# Altium schematic sheet [08]-PumpDriverUnit.SchDoc: RS232 and RS422/RS485 (part 2 of 3)
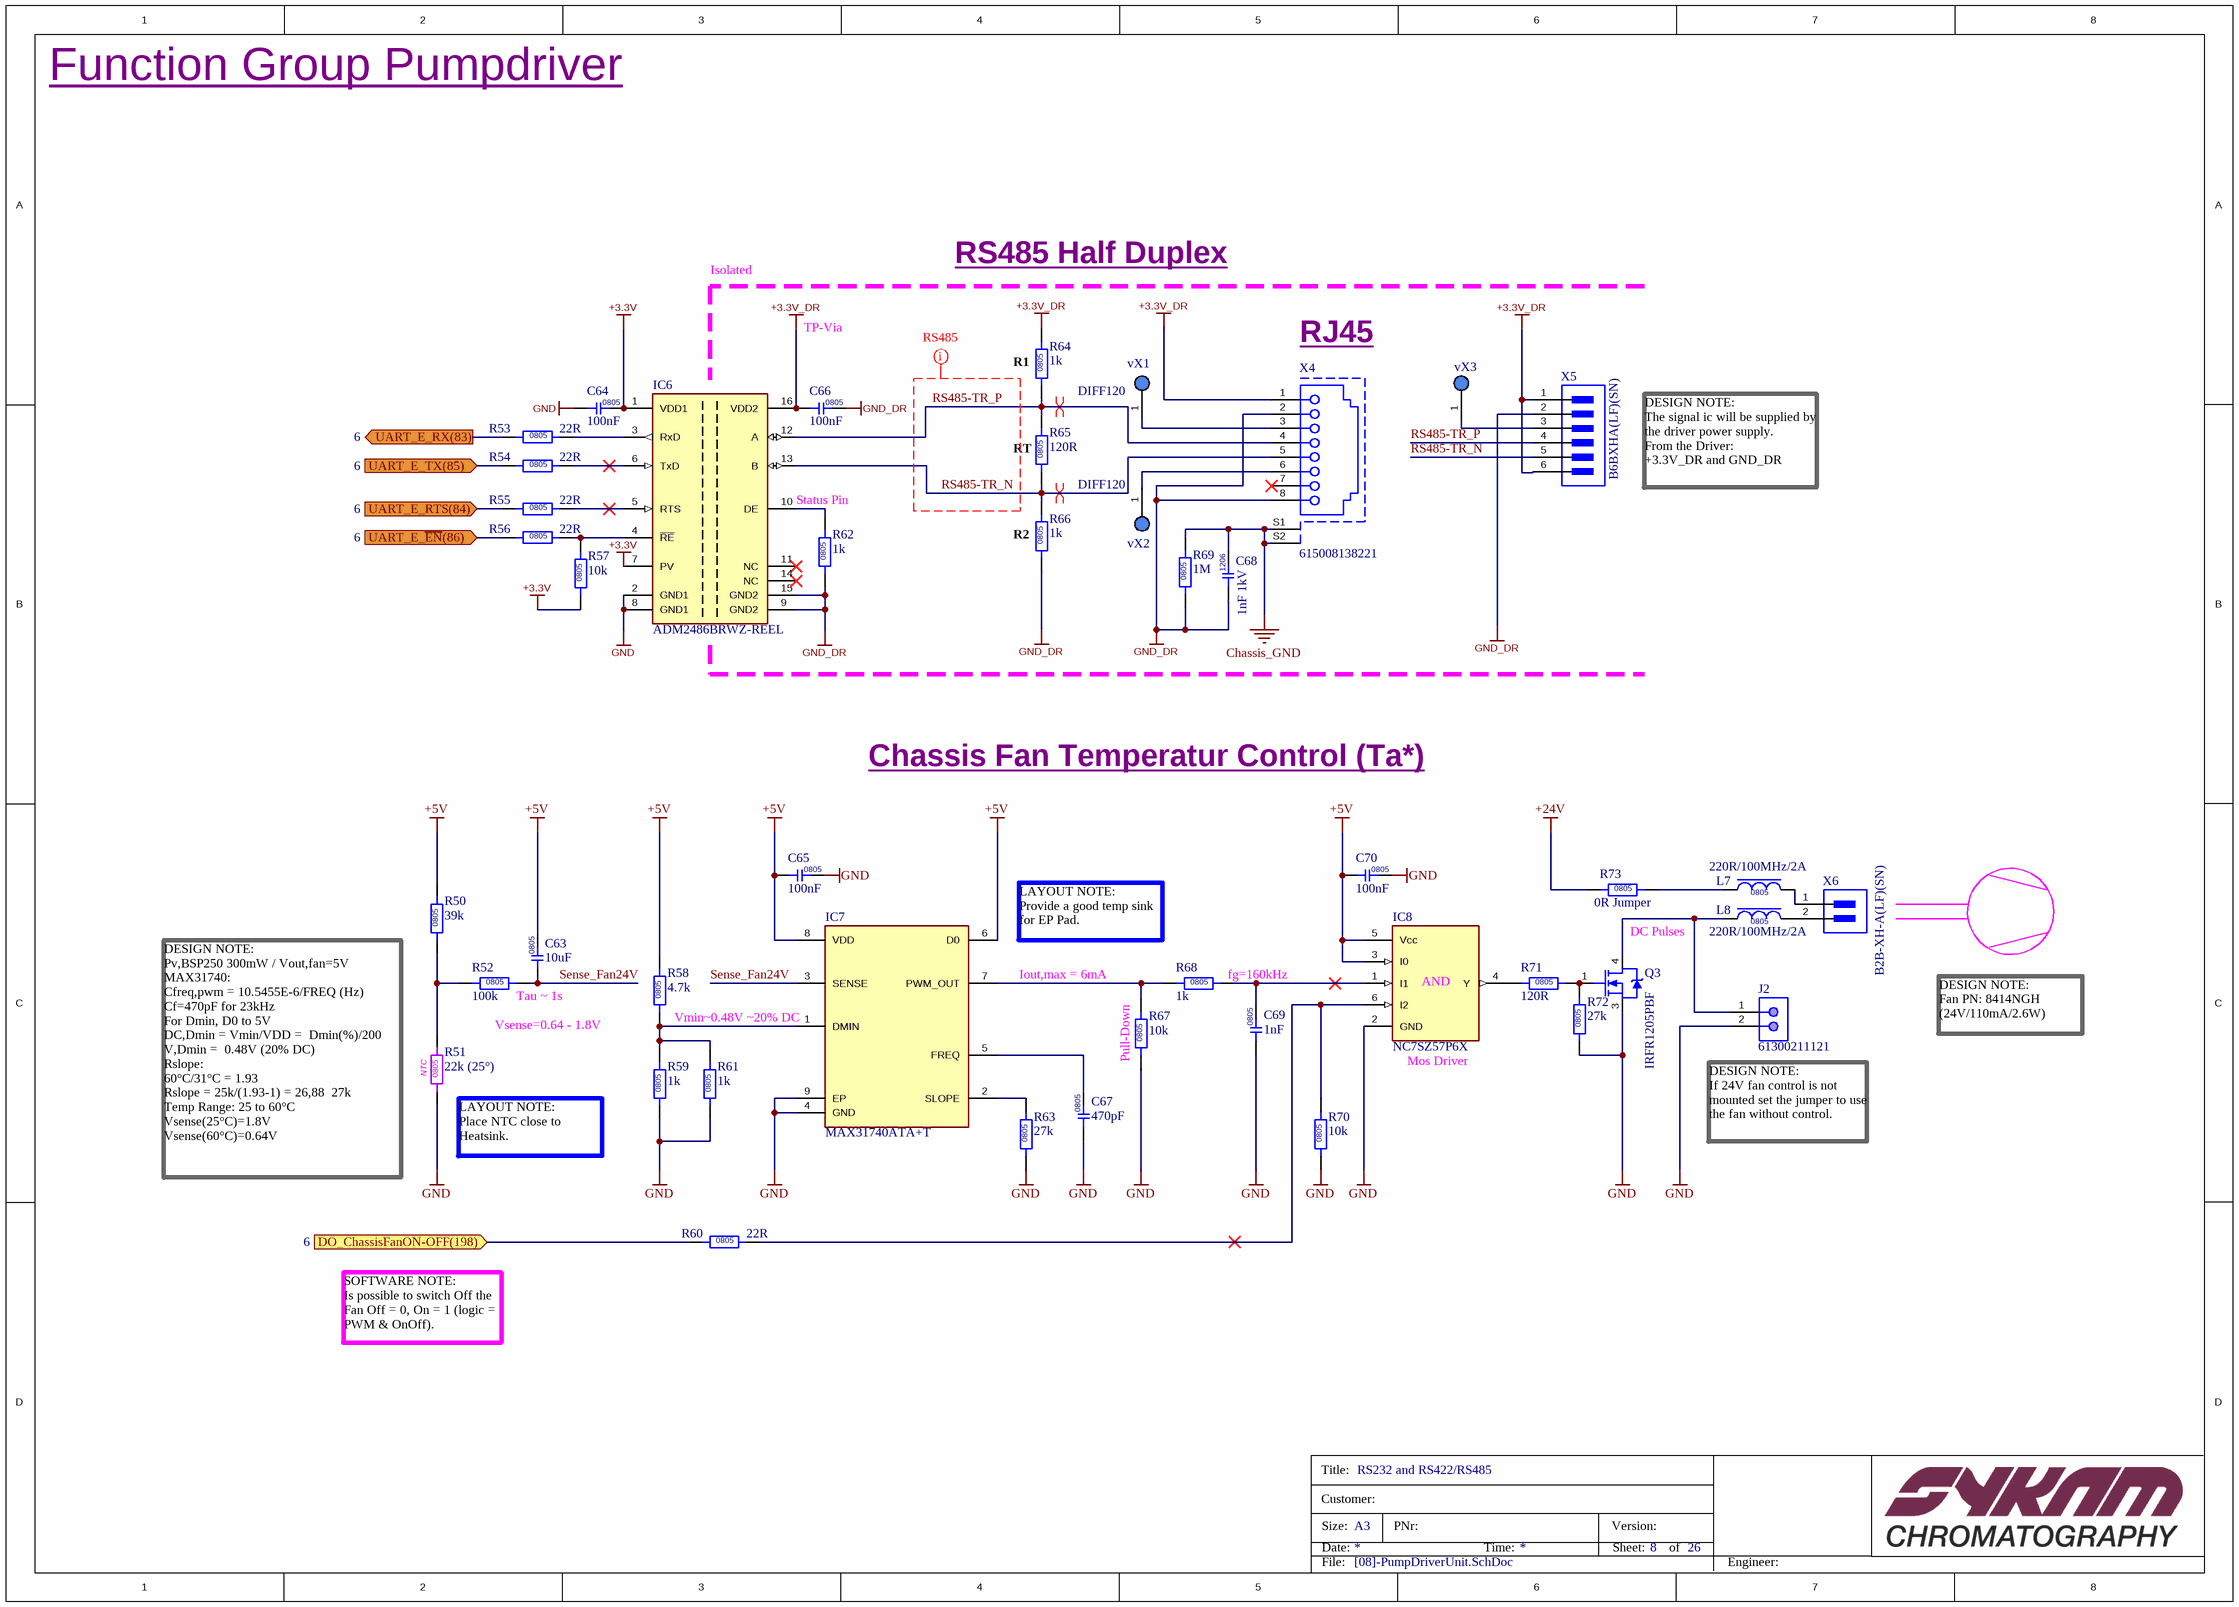
[diagram p1: [08]-PumpDriverUnit.SchDoc]
## Library data of the parts
C63 = C_10uF_GRM21BR6YA106ME43L: 0805 10 uF 50 V ±20% Tolerance X5R Multilayer Ceramic Capacitor; Manufacturer: Murata; Voltage Rating: 35V; Supplier 1: Digi-Key; Manufacturer Part Number: GRM21BR6YA106ME43L; RoHS: Yes; Category: Ceramic Capacitors; Stock 1: 143980; Pricing 1: 1=0,48000, 10=0,33200, 100=0,19920, 500=0,14942, 1000=0,12617 (USD); Mount: Surface Mount; Case/Package: 0805; Weight: 0.000335oz; Case Code (Imperial): 0805; Case Code (Metric): 2012; Min Operating Temperature: -55°C; Max Operating Temperature: 85°C; Tolerance: 20%; Capacitance: 10uF; Packaging: Tape and Reel; Dielectric: X5R; Termination: SMD/SMT; Voltage Rating (DC): 35V; Package Quantity: 3000; Length: 0.079inch; Height: 1.25mm; Width: 0.049inch; Thickness: 0.057inch; ComponentLink1URL: http://www.mouser.com/ds/2/281/c02e-2905.pdf?src-supplier=Mouser; ComponentLink1Description: http://www.mouser.com/ds/2/281/c02e-2905.pdf?src-supplier=Mouser; ComponentLink2URL: http://search.murata.co.jp/Ceramy/image/img/A01X/G101/ENG/GRM21BR6YA106ME43-01.pdf?src-supplier=Digi-Key; ComponentLink2Description: http://search.murata.co.jp/Ceramy/image/img/A01X/G101/ENG/GRM21BR6YA106ME43-01.pdf?src-supplier=Digi-Key; Supplier Part Number 1: 490-10515-6-ND
C64 C66 = C_100nF_CC0805KRX7R9BB104: CAP CER 0.1UF 50V X7R 0805; Manufacturer: Yageo; Material: Ceramic; Tolerance: 10%; Insulation Resistance: 100GR; Supplier 1: Digi-Key; Manufacturer Part Number: CC0805KRX7R9BB104; RoHS: Yes; Category: Ceramic Capacitors; Mount: Surface Mount; Case/Package: 0805; Number of Pins: 2; Case Code (Metric): 2012; Case Code (Imperial): 0805; Min Operating Temperature: -55°C; Max Operating Temperature: 125°C; Packaging: Tape and Reel; Capacitance: 100nF; Voltage Rating: 50V; Package Quantity: 1; Dielectric: X7R; Termination: SMD/SMT; Voltage: 50V; Length: 2mm; Height: 0.85mm; Width: 0.049inch; Thickness: 0.033inch; Depth: 1.25mm; Radiation Hardening: No; REACH SVHC: No SVHC; Lead Free: Lead Free; Halogen Free: Halogen Free; ComponentLink1URL: https://datasheet.ciiva.com/11786/0900766b80d84f1d-11786009.pdf?src-supplier=RSComponents; ComponentLink1Description: https://datasheet.ciiva.com/11786/0900766b80d84f1d-11786009.pdf?src-supplier=RSComponents; ComponentLink2URL: https://datasheet.ciiva.com/11464/upy-gphc-x7r-6-3v-to-50v-8-11464757.pdf?src-supplier=Avnet; ComponentLink2Description: https://datasheet.ciiva.com/11464/upy-gphc-x7r-6-3v-to-50v-8-11464757.pdf?src-supplier=Avnet; ComponentLink3URL: https://datasheet.ciiva.com/28450/1489800-28450805.pdf?src-supplier=Element14; ComponentLink3Description: https://datasheet.ciiva.com/28450/1489800-28450805.pdf?src-supplier=Element14; ComponentLink4URL: https://datasheet.ciiva.com/155/mlccorderingcode-155929.pdf?src-supplier=Digi-Key; ComponentLink4Description: https://datasheet.ciiva.com/155/mlccorderingcode-155929.pdf?src-supplier=Digi-Key; ComponentLink5URL: https://datasheet.ciiva.com/155/mlccorderingcode-155930.pdf?src-supplier=Digi-Key; ComponentLink5Description: https://datasheet.ciiva.com/155/mlccorderingcode-155930.pdf?src-supplier=Digi-Key; ComponentLink6URL: https://datasheet.ciiva.com/155/mlccorderingcode-155931.pdf?src-supplier=Digi-Key; ComponentLink6Description: https://datasheet.ciiva.com/155/mlccorderingcode-155931.pdf?src-supplier=Digi-Key; ComponentLink7URL: https://datasheet.ciiva.com/46393/1734573-46393307.pdf?src-supplier=Element14; ComponentLink7Description: https://datasheet.ciiva.com/46393/1734573-46393307.pdf?src-supplier=Element14; ComponentLink8URL: https://datasheet.ciiva.com/16625/upy-gphc-x7r-6-3v-to-50v-8-16625549.pdf?src-supplier=Avnet+Europe; ComponentLink8Description: https://datasheet.ciiva.com/16625/upy-gphc-x7r-6-3v-to-50v-8-16625549.pdf?src-supplier=Avnet+Europe; ComponentLink9URL: https://datasheet.ciiva.com/29242/445210-da-01-en-kerko-chip-0805-x7r-0-1uf-10proz-50vg-29242074.pdf?src-supplier=Conrad; ComponentLink9Description: https://datasheet.ciiva.com/29242/445210-da-01-en-kerko-chip-0805-x7r-0-1uf-10proz-50vg-29242074.pdf?src-supplier=Conrad; Supplier Part Number 1: 311-1140-6-ND; Stock 1: 7118979
C65 C70 = C_100nF_CC0805KRX7R9BB104: CAP CER 0.1UF 50V X7R 0805; Manufacturer: Yageo; Material: Ceramic; Tolerance: 10%; Insulation Resistance: 100GR; PCBChecked: initials after Checked; Supplier 1: Digi-Key; Manufacturer Part Number: CC0805KRX7R9BB104; RoHS: Yes; Category: Ceramic Capacitors; Mount: Surface Mount; Case/Package: 0805; Number of Pins: 2; Case Code (Metric): 2012; Case Code (Imperial): 0805; Min Operating Temperature: -55°C; Max Operating Temperature: 125°C; Packaging: Tape and Reel; Capacitance: 100nF; Voltage Rating: 50V; Package Quantity: 1; Dielectric: X7R; Termination: SMD/SMT; Voltage: 50V; Length: 2mm; Height: 0.85mm; Width: 0.049inch; Thickness: 0.033inch; Depth: 1.25mm; Radiation Hardening: No; REACH SVHC: No SVHC; Lead Free: Lead Free; Halogen Free: Halogen Free; ComponentLink1URL: https://datasheet.ciiva.com/11786/0900766b80d84f1d-11786009.pdf?src-supplier=RSComponents; ComponentLink1Description: https://datasheet.ciiva.com/11786/0900766b80d84f1d-11786009.pdf?src-supplier=RSComponents; ComponentLink2URL: https://datasheet.ciiva.com/11464/upy-gphc-x7r-6-3v-to-50v-8-11464757.pdf?src-supplier=Avnet; ComponentLink2Description: https://datasheet.ciiva.com/11464/upy-gphc-x7r-6-3v-to-50v-8-11464757.pdf?src-supplier=Avnet; ComponentLink3URL: https://datasheet.ciiva.com/28450/1489800-28450805.pdf?src-supplier=Element14; ComponentLink3Description: https://datasheet.ciiva.com/28450/1489800-28450805.pdf?src-supplier=Element14; ComponentLink4URL: https://datasheet.ciiva.com/155/mlccorderingcode-155929.pdf?src-supplier=Digi-Key; ComponentLink4Description: https://datasheet.ciiva.com/155/mlccorderingcode-155929.pdf?src-supplier=Digi-Key; ComponentLink5URL: https://datasheet.ciiva.com/155/mlccorderingcode-155930.pdf?src-supplier=Digi-Key; ComponentLink5Description: https://datasheet.ciiva.com/155/mlccorderingcode-155930.pdf?src-supplier=Digi-Key; ComponentLink6URL: https://datasheet.ciiva.com/155/mlccorderingcode-155931.pdf?src-supplier=Digi-Key; ComponentLink6Description: https://datasheet.ciiva.com/155/mlccorderingcode-155931.pdf?src-supplier=Digi-Key; ComponentLink7URL: https://datasheet.ciiva.com/46393/1734573-46393307.pdf?src-supplier=Element14; ComponentLink7Description: https://datasheet.ciiva.com/46393/1734573-46393307.pdf?src-supplier=Element14; ComponentLink8URL: https://datasheet.ciiva.com/16625/upy-gphc-x7r-6-3v-to-50v-8-16625549.pdf?src-supplier=Avnet+Europe; ComponentLink8Description: https://datasheet.ciiva.com/16625/upy-gphc-x7r-6-3v-to-50v-8-16625549.pdf?src-supplier=Avnet+Europe; ComponentLink9URL: https://datasheet.ciiva.com/29242/445210-da-01-en-kerko-chip-0805-x7r-0-1uf-10proz-50vg-29242074.pdf?src-supplier=Conrad; ComponentLink9Description: https://datasheet.ciiva.com/29242/445210-da-01-en-kerko-chip-0805-x7r-0-1uf-10proz-50vg-29242074.pdf?src-supplier=Conrad; Supplier Part Number 1: 311-1140-6-ND; Stock 1: 7118979; IPC7352C: done; SCHChecked: Initials after checked
C67 = C_470pF_08051A471JAT2A: AVX - 08051A471JAT2A - SMD Multilayer Ceramic Capacitor, 470 pF, 100 V, 0805 [2012 Metric], ± 5%, C0G / NP0, AVX 0805 MLCC; Manufacturer: Kyocera AVX; Voltage Rating: 100V; Dissipation Factor: 2.5%; Temperature Coefficient: 30ppm/°C; Insulation Resistance: 100GR; Supplier 1: Farnell; Manufacturer Part Number: 08051A471JAT2A; RoHS: Yes; Category: Ceramic Capacitors; Stock 1: 24000; Pricing 1: 4000=0,03540, 20000=0,02240 (EUR); Mount: Surface Mount,PCB; Case/Package: 0805; Number of Pins: 2; Case Code (Imperial): 0805; Case Code (Metric): 2012; Contact Plating: Tin,Matte; Min Operating Temperature: -55°C; Max Operating Temperature: 125°C; Capacitance: 470pF; Tolerance: 5%; Voltage Rating (DC): 100V; Packaging: Tape and Reel; Dielectric: C0G; Package Quantity: 1; Termination: SMD/SMT; Voltage: 100V; Length: 2.01mm; Width: 1.25mm; Height: 0.94mm; Thickness: 0.037inch; Depth: 1.25mm; Radiation Hardening: No; REACH SVHC: No SVHC; Lead Free: Lead Free; ComponentLink1URL: https://datasheet.ciiva.com/11787/0900766b802d4697-11787179.pdf?src-supplier=RSComponents; ComponentLink1Description: https://datasheet.ciiva.com/11787/0900766b802d4697-11787179.pdf?src-supplier=RSComponents; ComponentLink2URL: https://datasheet.ciiva.com/19476/2010384-19476174.pdf?src-supplier=Jameco; ComponentLink2Description: https://datasheet.ciiva.com/19476/2010384-19476174.pdf?src-supplier=Jameco; ComponentLink3URL: https://datasheet.ciiva.com/11536/ccog-11536997.pdf?src-supplier=Avnet; ComponentLink3Description: https://datasheet.ciiva.com/11536/ccog-11536997.pdf?src-supplier=Avnet; ComponentLink4URL: https://datasheet.ciiva.com/14590/70001042-14590309.pdf?src-supplier=Allied+Electronics; ComponentLink4Description: https://datasheet.ciiva.com/14590/70001042-14590309.pdf?src-supplier=Allied+Electronics; ComponentLink5URL: https://datasheet.ciiva.com/14594/70001042-14594869.pdf?src-supplier=Allied+Electronics; ComponentLink5Description: https://datasheet.ciiva.com/14594/70001042-14594869.pdf?src-supplier=Allied+Electronics; ComponentLink6URL: https://datasheet.ciiva.com/2987/ccog-2987926.pdf?src-supplier=Avnet; ComponentLink6Description: https://datasheet.ciiva.com/2987/ccog-2987926.pdf?src-supplier=Avnet; ComponentLink7URL: https://datasheet.ciiva.com/5424/ccog-243403-5424886.pdf?src-supplier=Mouser; ComponentLink7Description: https://datasheet.ciiva.com/5424/ccog-243403-5424886.pdf?src-supplier=Mouser; ComponentLink8URL: https://datasheet.ciiva.com/28546/759117-28546679.pdf?src-supplier=Element14; ComponentLink8Description: https://datasheet.ciiva.com/28546/759117-28546679.pdf?src-supplier=Element14; ComponentLink9URL: https://datasheet.ciiva.com/151/ccog-151179.pdf?src-supplier=Digi-Key; ComponentLink9Description: https://datasheet.ciiva.com/151/ccog-151179.pdf?src-supplier=Digi-Key; ComponentLink10URL: https://datasheet.ciiva.com/151/ccog-151180.pdf?src-supplier=Digi-Key; ComponentLink10Description: https://datasheet.ciiva.com/151/ccog-151180.pdf?src-supplier=Digi-Key; ComponentLink11URL: https://datasheet.ciiva.com/6150/26712-6150332.pdf?src-supplier=Farnell; ComponentLink11Description: https://datasheet.ciiva.com/6150/26712-6150332.pdf?src-supplier=Farnell; ComponentLink12URL: https://datasheet.ciiva.com/151/ccog-151181.pdf?src-supplier=Digi-Key; ComponentLink12Description: https://datasheet.ciiva.com/151/ccog-151181.pdf?src-supplier=Digi-Key; ComponentLink13URL: https://datasheet.ciiva.com/7811/759117-7811903.pdf?src-supplier=Element14; ComponentLink13Description: https://datasheet.ciiva.com/7811/759117-7811903.pdf?src-supplier=Element14; Supplier Part Number 1: 2280932
C68 = C_1nF-1kV-CGA5F1X7S3A102M085AE: CAP CER 1000PF 1KV X7S 1206; Manufacturer: TDK; Tolerance: 20%; Supplier 1: Mouser; Manufacturer Part Number: CGA5F1X7S3A102M085AE; RoHS: Yes; Category: Ceramic Capacitors; Stock 1: 11858; Pricing 1: 1=0,94000, 10=0,71800, 100=0,51400, 500=0,39800, 1000=0,34300, 4000=0,25700 (USD); Mount: Surface Mount; Case/Package: 1206; Weight: 0.000571oz; Case Code (Imperial): 1206; Case Code (Metric): 3216; Min Operating Temperature: -55°C; Max Operating Temperature: 125°C; Features: Soft Termination; Dielectric: X7S; Package Quantity: 4000; Packaging: Tape and Reel; Capacitance: 1nF; Voltage Rating: 1kV; Termination: SMD/SMT; Voltage Rating (DC): 1kV; Length: 0.126inch; Height: 0.85mm; Width: 0.063inch; Thickness: 0.039inch; Ratings: AEC-Q200; ComponentLink1URL: http://www.mouser.com/ds/2/400/lcc_commercial_soft_en-775842.pdf?src-supplier=Mouser; ComponentLink1Description: http://www.mouser.com/ds/2/400/lcc_commercial_soft_en-775842.pdf?src-supplier=Mouser; ComponentLink2URL: https://product.tdk.com/info/en/catalog/spec/mlccspec_automotive_highvoltage_en.pdf?src-supplier=Digi-Key; ComponentLink2Description: https://product.tdk.com/info/en/catalog/spec/mlccspec_automotive_highvoltage_en.pdf?src-supplier=Digi-Key; ComponentLink3URL: https://product.tdk.com/info/en/catalog/datasheets/mlcc_automotive_highvoltage_en.pdf?src-supplier=Digi-Key; ComponentLink3Description: https://product.tdk.com/info/en/catalog/datasheets/mlcc_automotive_highvoltage_en.pdf?src-supplier=Digi-Key; ComponentLink4URL: http://product.tdk.com/capacitor/mlcc/en/documents/mlcc_automotive_soft_en.pdf?src-supplier=Avnet; ComponentLink4Description: http://product.tdk.com/capacitor/mlcc/en/documents/mlcc_automotive_soft_en.pdf?src-supplier=Avnet; Supplier Part Number 1: 810-CGA5F1X7S3A102ME
C69 = C_1nF_C0805C102K5RAC7411: Multilayer Ceramic Capacitors MLCC - SMD/SMT 50volts 1000pF X7R 10%; Manufacturer: KEMET; Voltage Rating: 50V; Manufacturer Part Number: C0805C102K5RAC7411; RoHS: Yes; Category: Ceramic Capacitors; Stock 1: 30000; Pricing 1: 15000=0,01862, 30000=0,01764 (USD); Mount: Surface Mount; Case/Package: 0805; Case Code (Metric): 2012; Case Code (Imperial): 0805; Dielectric Material: Ceramic; Min Operating Temperature: -55°C; Max Operating Temperature: 125°C; Termination: SMD/SMT; Capacitance: 1nF; Package Quantity: 15000; Voltage Rating (DC): 50V; Tolerance: 10%; Packaging: Tape and Reel; Dielectric: X7R; Length: 0.079inch; Height: 0.78mm; Thickness: 0.035inch; Width: 0.049inch; ComponentLink1URL: http://components.arrow.com/part/dataview/0323_00324664?src-supplier=Arrow+Europe; ComponentLink1Description: http://components.arrow.com/part/dataview/0323_00324664?src-supplier=Arrow+Europe; ComponentLink2URL: http://www.mouser.com/ds/2/212/KEM_C1002_X7R_SMD-1102033.pdf?src-supplier=Mouser; ComponentLink2Description: http://www.mouser.com/ds/2/212/KEM_C1002_X7R_SMD-1102033.pdf?src-supplier=Mouser; ComponentLink3URL: https://api.kemet.com/component-edge/download/datasheet/C0805C102K5RAC7411.pdf?src-supplier=Digi-Key; ComponentLink3Description: https://api.kemet.com/component-edge/download/datasheet/C0805C102K5RAC7411.pdf?src-supplier=Digi-Key; Supplier 1: Digi-Key; Supplier Part Number 1: 311-1127-1-ND
IC6 = IC_ADM2486BRWZ-REEL: Single Transmitter/Receiver RS-485 16-Pin SOIC W T/R; Manufacturer: Analog Devices; Number of Transmitters: 1; Logic Function: Transceiver; Number of Channels: 3; Data Rate: 20Mbps; Propagation Delay: 55ns; Max Supply Voltage: 5.5V; Min Supply Voltage: 2.7V; Nominal Supply Current: 3mA; Channel Type: Bidirectional; Isolated Power: No; Pulse Width Distortion (PWD): 5ns; Isolation Voltage: 2.5kV; Operating Supply Voltage: 5V; Simplex/Duplex: Half Duplex; Supplier 1: Mouser; Manufacturer Part Number: ADM2486BRWZ-REEL; RoHS: Yes; Category: Interface ICs; Mount: Surface Mount; Case/Package: SOIC; Number of Pins: 16; Contact Plating: Tin,Matte; Min Operating Temperature: -40°C; Max Operating Temperature: 85°C; Number of Receivers: 1; Packaging: Tape and Reel; Package Quantity: 1000; Operating Supply Current: 3mA; Number of Transceivers: 1; ESD Protection: No; Max Output Current: 3mA; Series: iCoupler®; Supply Current: 3mA; Lead Free: Contains Lead; RoHS Compliant: Yes; ComponentLink1URL: https://datasheet.ciiva.com/26832/adm2486brwz-reel-26832199.pdf?src-supplier=IIIC; ComponentLink1Description: https://datasheet.ciiva.com/26832/adm2486brwz-reel-26832199.pdf?src-supplier=IIIC; ComponentLink2URL: https://datasheet.ciiva.com/16641/adm2486-16641103.pdf?src-supplier=Avnet+Europe; ComponentLink2Description: https://datasheet.ciiva.com/16641/adm2486-16641103.pdf?src-supplier=Avnet+Europe; ComponentLink3URL: https://datasheet.ciiva.com/11301/adm2486-11301657.pdf?src-supplier=Avnet; ComponentLink3Description: https://datasheet.ciiva.com/11301/adm2486-11301657.pdf?src-supplier=Avnet; Supplier Part Number 1: 584-ADM2486BRWZ-R
IC7 = IC_MAX31740ATA+T: Fan Motor Speed Controller 3V to 5.5V 8-Pin TDFN EP T/R; Manufacturer: Maxim; Nominal Supply Current: 500uA; Number of Outputs: 1; Operating Supply Voltage: 3.3V; Supplier 1: Farnell; Manufacturer Part Number: MAX31740ATA+T; RoHS: Yes; Category: Interface ICs; Stock 1: 3651; Pricing 1: 1=0,68100, 25=0,65100, 50=0,63100, 100=0,51100, 250=0,51000, 500=0,49000, 1000=0,47000, 2500=0,44300 (EUR); Mount: Surface Mount; Number of Pins: 8; Min Operating Temperature: -40°C; Max Operating Temperature: 125°C; Packaging: Tape and Reel; Package Quantity: 2500; ComponentLink1URL: https://datasheet.ciiva.com/18624/max31740-18624789.pdf?src-supplier=Digi-Key; ComponentLink1Description: https://datasheet.ciiva.com/18624/max31740-18624789.pdf?src-supplier=Digi-Key; Supplier Part Number 1: 2909738
IC8 = IC_NC7SZ57P6X: FAIRCHILD SEMICONDUCTOR         NC7SZ57P6X.            Multi-Function Logic Gate, Configurable, Ultra High Speed, 3 Input, 32 mA, 1.65V to 5.5V, SC-70-6; Manufacturer: ON Semiconductor / Fairchild; High Level Output Current: -32mA; Low Level Output Current: 32mA; Number of Gates: 1; Propagation Delay: 14.5ns; Logic Function: Multi Function; Quiescent Current: 1uA; Number of Inputs: 2; Schmitt Trigger Input: Yes; PCBChecked: initials after Checked; Supplier 1: Digi-Key; Manufacturer Part Number: NC7SZ57P6X; RoHS: Yes; Category: Logic Gates; Mount: Surface Mount; Case/Package: SC; Number of Pins: 6; Weight: 0.028g; Number of Terminals: 6; Min Operating Temperature: -40°C; Max Operating Temperature: 85°C; Max Supply Voltage: 5.5V; Min Supply Voltage: 1.65V; Packaging: Tape and Reel; Number of Circuits: 1; Turn-On Delay Time: 14.5ns; Number of Outputs: 1; Number of Elements: 1; Output Current: 32mA; Package Quantity: 3000; Length: 2mm; Height: 1mm; Width: 1.25mm; Radiation Hardening: No; Lead Free: Lead Free; REACH SVHC: No SVHC; ComponentLink1URL: https://datasheet.ciiva.com/34301/874445-34301638.pdf?src-supplier=Jameco; ComponentLink1Description: https://datasheet.ciiva.com/34301/874445-34301638.pdf?src-supplier=Jameco; ComponentLink2URL: https://datasheet.ciiva.com/25628/0900766b80f9b61c-25628492.pdf?src-supplier=RSComponents; ComponentLink2Description: https://datasheet.ciiva.com/25628/0900766b80f9b61c-25628492.pdf?src-supplier=RSComponents; ComponentLink3URL: https://datasheet.ciiva.com/15090/getdatasheetpartid-53023-15090335.pdf?src-supplier=Verical; ComponentLink3Description: https://datasheet.ciiva.com/15090/getdatasheetpartid-53023-15090335.pdf?src-supplier=Verical; ComponentLink4URL: https://datasheet.ciiva.com/1880/nc7sz57-1880020.pdf?src-supplier=Digi-Key; ComponentLink4Description: https://datasheet.ciiva.com/1880/nc7sz57-1880020.pdf?src-supplier=Digi-Key; ComponentLink5URL: https://datasheet.ciiva.com/8249/nc7sz57-8249558.pdf?src-supplier=Avnet; ComponentLink5Description: https://datasheet.ciiva.com/8249/nc7sz57-8249558.pdf?src-supplier=Avnet; ComponentLink6URL: https://datasheet.ciiva.com/16503/nc7sz57-16503560.pdf?src-supplier=Avnet+Asia; ComponentLink6Description: https://datasheet.ciiva.com/16503/nc7sz57-16503560.pdf?src-supplier=Avnet+Asia; ComponentLink7URL: https://datasheet.ciiva.com/1880/nc7sz57-1880021.pdf?src-supplier=Digi-Key; ComponentLink7Description: https://datasheet.ciiva.com/1880/nc7sz57-1880021.pdf?src-supplier=Digi-Key; ComponentLink8URL: https://datasheet.ciiva.com/7970/1727673-7970677.pdf?src-supplier=Element14; ComponentLink8Description: https://datasheet.ciiva.com/7970/1727673-7970677.pdf?src-supplier=Element14; ComponentLink9URL: https://datasheet.ciiva.com/1880/nc7sz57-1880022.pdf?src-supplier=Digi-Key; ComponentLink9Description: https://datasheet.ciiva.com/1880/nc7sz57-1880022.pdf?src-supplier=Digi-Key; ComponentLink10URL: https://datasheet.ciiva.com/16977/nc7sz57-16977945.pdf?src-supplier=Future+Electronics; ComponentLink10Description: https://datasheet.ciiva.com/16977/nc7sz57-16977945.pdf?src-supplier=Future+Electronics; Supplier Part Number 1: NC7SZ57P6XCT-ND; Stock 1: 16277; IPC7352C: done; SCHChecked: Initials after checked
J2 = CON_J_61300211121: WURTH ELEKTRONIK - 61300211121 - Pin Header, Vertical, Board-to-Board, 2.54 mm, 1 Rows, 2 Contacts, Through Hole Straight; Manufacturer: Wurth Electronics; Current Rating: 3A; Voltage Rating: 250V; Number of Positions: 2; Gender: Male; Connector Type: Male Pin; Pitch: 0.1inch; Supplier 1: Farnell; Manufacturer Part Number: 61300211121; RoHS: Yes; Category: Headers and Wire Housings; Stock 1: 10705; Pricing 1: 100=0,05670, 500=0,05560, 1000=0,05440, 2500=0,05330, 5000=0,05220, 10000=0,05100 (EUR); Mount: Through Hole; Contact Plating: Gold; Housing Material: PBT; Contact Material: Copper Alloy,Copper; Color: Black; Min Operating Temperature: -40°C; Max Operating Temperature: 125°C; Number of Rows: 1; Contact Gender: Male; Packaging: Bulk; Termination: Through Hole; Number of Contacts: 2; Contact Mating Length: 0.236inch; REACH SVHC: Unknown; Lead Free: Lead Free; ComponentLink1URL: https://datasheet.ciiva.com/13619/6130xx11121-48870-13619345.pdf?src-supplier=Mouser; ComponentLink1Description: https://datasheet.ciiva.com/13619/6130xx11121-48870-13619345.pdf?src-supplier=Mouser; Supplier Part Number 1: 2356153
L7 L8 = L_BLM21PG221SN1D: Ferrite Beads Multi-Layer 220Ohm 25% 100MHz 2A 45mOhm DCR 0805 Paper T/R; Manufacturer: Murata; Material: Ferrite,Steel; Shielding: Unshielded; Number of Circuits: 1; DC Resistance (DCR): 45mR; Impedance: 220R; PCBChecked: initials after Checked; Supplier 1: Digi-Key; Manufacturer Part Number: BLM21PG221SN1D; RoHS: Yes; Category: Ferrite Beads and Chips; Case/Package: 0805; Number of Pins: 2; Case Code (Imperial): 0805; Core Material: Ferrite; Contact Plating: Tin,Matte; Case Code (Metric): 2012; Min Operating Temperature: -55°C; Max Operating Temperature: 125°C; Frequency: 100MHz; Number of Lines: 1; Max DC Current: 2A; Termination: SMD/SMT; Test Frequency: 100MHz; DC Current: 2A; Military Standard: Not; Current: 2A; Package Quantity: 1; Tolerance: 25%; Max Current Rating: 2A; Packaging: Tape and Reel; Current Rating: 2A; Length: 2mm; Height: 0.85mm; Depth: 1.25mm; Width: 1.25mm; Radiation Hardening: No; Lead Free: Lead Free; REACH SVHC: No SVHC; ComponentLink1URL: https://datasheet.ciiva.com/1012/l0110s0100blm21p-1012288.pdf?src-supplier=Digi-Key; ComponentLink1Description: https://datasheet.ciiva.com/1012/l0110s0100blm21p-1012288.pdf?src-supplier=Digi-Key; ComponentLink2URL: https://datasheet.ciiva.com/11799/0900766b81275e31-11799232.pdf?src-supplier=RSComponents; ComponentLink2Description: https://datasheet.ciiva.com/11799/0900766b81275e31-11799232.pdf?src-supplier=RSComponents; ComponentLink3URL: https://datasheet.ciiva.com/30514/1845321-30514028.pdf?src-supplier=Jameco; ComponentLink3Description: https://datasheet.ciiva.com/30514/1845321-30514028.pdf?src-supplier=Jameco; ComponentLink4URL: https://datasheet.ciiva.com/29348/442529-da-01-en-chip-drossel-0805-220r-2000ma-2-0x1-25mm-29348007.pdf?src-supplier=Conrad; ComponentLink4Description: https://datasheet.ciiva.com/29348/442529-da-01-en-chip-drossel-0805-220r-2000ma-2-0x1-25mm-29348007.pdf?src-supplier=Conrad; ComponentLink5URL: https://datasheet.ciiva.com/1012/l0110s0100blm21p-1012289.pdf?src-supplier=Digi-Key; ComponentLink5Description: https://datasheet.ciiva.com/1012/l0110s0100blm21p-1012289.pdf?src-supplier=Digi-Key; ComponentLink6URL: https://datasheet.ciiva.com/16215/l0110s0100blm21p-16215194.pdf?src-supplier=Future+Electronics; ComponentLink6Description: https://datasheet.ciiva.com/16215/l0110s0100blm21p-16215194.pdf?src-supplier=Future+Electronics; ComponentLink7URL: https://datasheet.ciiva.com/8021/1756152-8021598.pdf?src-supplier=Element14; ComponentLink7Description: https://datasheet.ciiva.com/8021/1756152-8021598.pdf?src-supplier=Element14; ComponentLink8URL: https://datasheet.ciiva.com/14122/anblm21p-data-e-14122214.pdf?src-supplier=Distrelec; ComponentLink8Description: https://datasheet.ciiva.com/14122/anblm21p-data-e-14122214.pdf?src-supplier=Distrelec; ComponentLink9URL: https://datasheet.ciiva.com/3081/l0110s0100blm21p-3081655.pdf?src-supplier=Avnet; ComponentLink9Description: https://datasheet.ciiva.com/3081/l0110s0100blm21p-3081655.pdf?src-supplier=Avnet; ComponentLink10URL: https://datasheet.ciiva.com/8021/1756152-8021596.pdf?src-supplier=Element14; ComponentLink10Description: https://datasheet.ciiva.com/8021/1756152-8021596.pdf?src-supplier=Element14; Supplier Part Number 1: 490-1054-6-ND; Stock 1: 868092; IPC7352C: done; SCHChecked: Initials after checked
Q3 = Q_NMOS-IRFR1205PBF: HEXFET(R) Power MOSFET, 55 V, 44 A, 27 mOhm, -55 to 175 degC, 3-Pin DPAK (TO-252AA), RoHS, Tube; Manufacturer: International Rectifier; Drain-to-Source Voltage [Vdss]: 55V; Rated Power Dissipation: 107W; Channel Type: N-Channel; Qg Gate Charge: 65nC; Drain-Source On Resistance-Max: 0.027O; Mounting Technology: SurfaceMount; Package Reference: TO-252AA-3; Datasheet URL: http://www.infineon.com/dgdl/irfr1205pbf.pdf?fileId=5546d462533600a40153562d17792047; Package Description: 3-Pin Surface Mount Device, Body 6.54 x 6.095 mm, Pitch 2.29 mm; Manufacturer URL: http://internationalrectifier.com/; Datasheet Version: 12/2004
R50 = R_39k_CRCW080539K0FKEA: Res Thick Film 0805 39K Ohm 1% 0.125W(1/8W) ±100ppm/C Pad SMD Automotive T/R; Manufacturer: Vishay; Resistance: 39kR; Power Rating: 125mW; Voltage Rating: 150V; Temperature Coefficient: 100ppm/°C; Supplier 1: Farnell; Manufacturer Part Number: CRCW080539K0FKEA; RoHS: Yes; Category: Chip SMD Resistors; Stock 1: 32759; Pricing 1: 10=0,07080, 100=0,02940, 500=0,02070, 1000=0,01200, 2500=0,00860, 5000=0,00610, 25000=0,00540 (EUR); Case/Package: 0805; Number of Pins: 2; Contact Plating: Tin; Weight: 0.000194oz; Case Code (Metric): 2012; Case Code (Imperial): 0805; Min Operating Temperature: -55°C; Max Operating Temperature: 155°C; Packaging: Tape and Reel; Package Quantity: 10; Tolerance: 1%; Resistor Type: Thick Film; Number of Terminations: 2; Termination: SMD/SMT; Max Power Dissipation: 125mW; Voltage Rating (DC): 150V; Features: Automotive AEC-Q200; Length: 2mm; Width: 0.049inch; Height: 0.45mm; Depth: 1.25mm; Radiation Hardening: No; Lead Free: Lead Free; REACH SVHC: Unknown; Military Standard: Not; ComponentLink1URL: https://datasheet.ciiva.com/11809/0900766b80d98b26-11809202.pdf?src-supplier=RSComponents; ComponentLink1Description: https://datasheet.ciiva.com/11809/0900766b80d98b26-11809202.pdf?src-supplier=RSComponents; ComponentLink2URL: https://datasheet.ciiva.com/2467/dcrcwe3-2467602.pdf?src-supplier=Digi-Key; ComponentLink2Description: https://datasheet.ciiva.com/2467/dcrcwe3-2467602.pdf?src-supplier=Digi-Key; ComponentLink3URL: https://datasheet.ciiva.com/2467/dcrcwe3-2467603.pdf?src-supplier=Digi-Key; ComponentLink3Description: https://datasheet.ciiva.com/2467/dcrcwe3-2467603.pdf?src-supplier=Digi-Key; ComponentLink4URL: https://datasheet.ciiva.com/2467/dcrcwe3-2467604.pdf?src-supplier=Digi-Key; ComponentLink4Description: https://datasheet.ciiva.com/2467/dcrcwe3-2467604.pdf?src-supplier=Digi-Key; ComponentLink5URL: https://datasheet.ciiva.com/7841/1697337-7841669.pdf?src-supplier=Element14; ComponentLink5Description: https://datasheet.ciiva.com/7841/1697337-7841669.pdf?src-supplier=Element14; ComponentLink6URL: https://datasheet.ciiva.com/16852/dcrcwe3-16852278.pdf?src-supplier=Avnet+Europe; ComponentLink6Description: https://datasheet.ciiva.com/16852/dcrcwe3-16852278.pdf?src-supplier=Avnet+Europe; ComponentLink7URL: https://datasheet.ciiva.com/26314/fld-crcw-e3-data-en-26314582.pdf?src-supplier=Distrelec; ComponentLink7Description: https://datasheet.ciiva.com/26314/fld-crcw-e3-data-en-26314582.pdf?src-supplier=Distrelec; ComponentLink8URL: https://datasheet.ciiva.com/16789/70201119-16789063.pdf?src-supplier=Allied+Electronics; ComponentLink8Description: https://datasheet.ciiva.com/16789/70201119-16789063.pdf?src-supplier=Allied+Electronics; ComponentLink9URL: https://datasheet.ciiva.com/5550/dcrcwe3-109170-5550664.pdf?src-supplier=Mouser; ComponentLink9Description: https://datasheet.ciiva.com/5550/dcrcwe3-109170-5550664.pdf?src-supplier=Mouser; ComponentLink10URL: https://datasheet.ciiva.com/16391/dcrcwe3-16391050.pdf?src-supplier=Future+Electronics; ComponentLink10Description: https://datasheet.ciiva.com/16391/dcrcwe3-16391050.pdf?src-supplier=Future+Electronics; ComponentLink11URL: https://datasheet.ciiva.com/7841/1533075-7841852.pdf?src-supplier=Element14; ComponentLink11Description: https://datasheet.ciiva.com/7841/1533075-7841852.pdf?src-supplier=Element14; Supplier Part Number 1: 1652993
R51 = R_NTC_22k_B57471V2223J062: Thermistor NTC 22K Ohm 5% 2-Pin 0805 Surface Mount Solder Pad 4455K Blister T/R; Manufacturer: TDK EPCOS; Resistance: 22kR; Power Rating: 210mW; Supplier 1: Digi-Key; Manufacturer Part Number: B57471V2223J062; RoHS: Yes; Category: Thermistors; Stock 1: 4625; Pricing 1: 1=0,57000, 5=0,53800, 10=0,46800, 25=0,41120, 50=0,34160, 100=0,29100, 500=0,25300, 1000=0,22138 (USD); Mount: Surface Mount; Case/Package: 0805; Number of Pins: 2; Weight: 0.000459oz; Contact Plating: Tin; Min Operating Temperature: -55°C; Max Operating Temperature: 125°C; Termination: SMD/SMT; Tolerance: 5%; Packaging: Tape and Reel; Package Quantity: 3000; Length: 2mm; Height: 1.3mm; Width: 1.25mm; Depth: 1.25mm; REACH SVHC: No SVHC; ComponentLink1URL: https://datasheet.ciiva.com/1302/91918-1302291.pdf?src-supplier=Farnell; ComponentLink1Description: https://datasheet.ciiva.com/1302/91918-1302291.pdf?src-supplier=Farnell; Supplier Part Number 1: 495-76313-1-ND
R52 = R_100k_RC0805FR-07100KL: RES SMD 100K OHM 1% 1/8W 0805; Manufacturer: Yageo; Resistance: 100kR; Temperature Coefficient: 100ppm/°C; Power Rating: 125mW; Voltage Rating (DC): 150V; PCBChecked: initials after Checked; Supplier 1: Digi-Key; Manufacturer Part Number: RC0805FR-07100KL; RoHS: Yes; Category: Chip SMD Resistors; Case/Package: 0805; Number of Pins: 2; Case Code (Metric): 2012; Case Code (Imperial): 0805; Min Operating Temperature: -55°C; Max Operating Temperature: 155°C; Tolerance: 1%; Packaging: Tape and Reel; Composition: Thick Film; Voltage Rating: 150V; Package Quantity: 1; Number of Terminations: 2; Termination: SMD/SMT; Military Standard: Not; Max Power Dissipation: 125mW; Features: Moisture Resistant; Length: 2mm; Height: 0.024inch; Width: 0.049inch; Depth: 1.25mm; Lead Pitch: 0.4mm; REACH SVHC: Unknown; Lead Free: Lead Free; ComponentLink1URL: https://datasheet.ciiva.com/11808/0900766b8106beab-11808858.pdf?src-supplier=RSComponents; ComponentLink1Description: https://datasheet.ciiva.com/11808/0900766b8106beab-11808858.pdf?src-supplier=RSComponents; ComponentLink2URL: https://datasheet.ciiva.com/2457/pyu-r-int-thick-7-2457017.pdf?src-supplier=Digi-Key; ComponentLink2Description: https://datasheet.ciiva.com/2457/pyu-r-int-thick-7-2457017.pdf?src-supplier=Digi-Key; ComponentLink3URL: https://datasheet.ciiva.com/12667/rc0805-12667001.pdf?src-supplier=Mouser; ComponentLink3Description: https://datasheet.ciiva.com/12667/rc0805-12667001.pdf?src-supplier=Mouser; ComponentLink4URL: https://datasheet.ciiva.com/2457/pyu-r-int-thick-7-2457018.pdf?src-supplier=Digi-Key; ComponentLink4Description: https://datasheet.ciiva.com/2457/pyu-r-int-thick-7-2457018.pdf?src-supplier=Digi-Key; ComponentLink5URL: https://datasheet.ciiva.com/16747/rc0805-16747226.pdf?src-supplier=Future+Electronics; ComponentLink5Description: https://datasheet.ciiva.com/16747/rc0805-16747226.pdf?src-supplier=Future+Electronics; ComponentLink6URL: https://datasheet.ciiva.com/2457/pyu-r-int-thick-7-2457019.pdf?src-supplier=Digi-Key; ComponentLink6Description: https://datasheet.ciiva.com/2457/pyu-r-int-thick-7-2457019.pdf?src-supplier=Digi-Key; ComponentLink7URL: https://datasheet.ciiva.com/7660/38627-7660796.pdf?src-supplier=Element14; ComponentLink7Description: https://datasheet.ciiva.com/7660/38627-7660796.pdf?src-supplier=Element14; ComponentLink8URL: https://datasheet.ciiva.com/7941/1697719-7941676.pdf?src-supplier=Element14; ComponentLink8Description: https://datasheet.ciiva.com/7941/1697719-7941676.pdf?src-supplier=Element14; ComponentLink9URL: https://datasheet.ciiva.com/7941/1686128-7941677.pdf?src-supplier=Element14; ComponentLink9Description: https://datasheet.ciiva.com/7941/1686128-7941677.pdf?src-supplier=Element14; ComponentLink10URL: https://datasheet.ciiva.com/7941/1697719-7941678.pdf?src-supplier=Element14; ComponentLink10Description: https://datasheet.ciiva.com/7941/1697719-7941678.pdf?src-supplier=Element14; ComponentLink11URL: https://datasheet.ciiva.com/22747/444164-22747534.pdf?src-supplier=Element14; ComponentLink11Description: https://datasheet.ciiva.com/22747/444164-22747534.pdf?src-supplier=Element14; Supplier Part Number 1: 311-100KCRCT-ND; Stock 1: 6543127; IPC7352C: done; SCHChecked: Initials after checked
R53-R56 = R_22R_RC0805FR-0722RL: RES SMD 22 OHM 1% 1/8W 0805; Manufacturer: Yageo; Temperature Coefficient: 100ppm/°C; Power Rating: 125mW; Voltage Rating: 150V; Supplier 1: Digi-Key; Manufacturer Part Number: RC0805FR-0722RL; RoHS: Yes; Category: Chip SMD Resistors; Case/Package: 0805; Case Code (Metric): 2012; Case Code (Imperial): 0805; Min Operating Temperature: -55°C; Max Operating Temperature: 155°C; Resistance: 22R; Tolerance: 1%; Packaging: Tape and Reel; Composition: Thick Film; Termination: SMD/SMT; Military Standard: Not; Package Quantity: 1; Number of Terminations: 2; Max Power Dissipation: 125mW; Features: Moisture Resistant; Working Voltage: 150V; Length: 0.079inch; Height: 0.024inch; Width: 0.049inch; Depth: 1.25mm; REACH SVHC: Unknown; Lead Free: Lead Free; ComponentLink1URL: https://datasheet.ciiva.com/11819/0900766b8106beab-11819837.pdf?src-supplier=RSComponents; ComponentLink1Description: https://datasheet.ciiva.com/11819/0900766b8106beab-11819837.pdf?src-supplier=RSComponents; ComponentLink2URL: https://datasheet.ciiva.com/2457/pyu-r-int-thick-7-2457045.pdf?src-supplier=Digi-Key; ComponentLink2Description: https://datasheet.ciiva.com/2457/pyu-r-int-thick-7-2457045.pdf?src-supplier=Digi-Key; ComponentLink3URL: https://datasheet.ciiva.com/2457/pyu-r-int-thick-7-2457046.pdf?src-supplier=Digi-Key; ComponentLink3Description: https://datasheet.ciiva.com/2457/pyu-r-int-thick-7-2457046.pdf?src-supplier=Digi-Key; ComponentLink4URL: https://datasheet.ciiva.com/12667/rc0805-12667371.pdf?src-supplier=Mouser; ComponentLink4Description: https://datasheet.ciiva.com/12667/rc0805-12667371.pdf?src-supplier=Mouser; ComponentLink5URL: https://datasheet.ciiva.com/2457/pyu-r-int-thick-7-2457044.pdf?src-supplier=Digi-Key; ComponentLink5Description: https://datasheet.ciiva.com/2457/pyu-r-int-thick-7-2457044.pdf?src-supplier=Digi-Key; ComponentLink6URL: https://datasheet.ciiva.com/46447/444164-46447574.pdf?src-supplier=Element14; ComponentLink6Description: https://datasheet.ciiva.com/46447/444164-46447574.pdf?src-supplier=Element14; Supplier Part Number 1: 311-22.0CRCT-ND; Stock 1: 302752
R57 R67 R70 = R_10k_RC0805FR-0710KL: RES SMD 10K OHM 1% 1/8W 0805; Manufacturer: Yageo; Temperature Coefficient: 100ppm/°C; Resistance: 10kR; Power Rating: 125mW; Voltage Rating: 150V; PCBChecked: initials after Checked; Supplier 1: Digi-Key; Manufacturer Part Number: RC0805FR-0710KL; RoHS: Yes; Category: Chip SMD Resistors; Case/Package: 0805; Case Code (Imperial): 0805; Case Code (Metric): 2012; Min Operating Temperature: -55°C; Max Operating Temperature: 155°C; Packaging: Tape and Reel; Tolerance: 1%; Composition: Thick Film; Features: Moisture Resistant; Termination: SMD/SMT; Number of Terminations: 2; Military Standard: Not; Max Power Dissipation: 125mW; Package Quantity: 1; Length: 2mm; Height: 0.024inch; Width: 0.049inch; Depth: 1.25mm; Lead Free: Lead Free; REACH SVHC: Unknown; ComponentLink1URL: https://datasheet.ciiva.com/11808/0900766b8106beab-11808151.pdf?src-supplier=RSComponents; ComponentLink1Description: https://datasheet.ciiva.com/11808/0900766b8106beab-11808151.pdf?src-supplier=RSComponents; ComponentLink2URL: https://datasheet.ciiva.com/12669/rc0805-12669688.pdf?src-supplier=Mouser; ComponentLink2Description: https://datasheet.ciiva.com/12669/rc0805-12669688.pdf?src-supplier=Mouser; ComponentLink3URL: https://datasheet.ciiva.com/2456/pyu-r-int-thick-7-2456973.pdf?src-supplier=Digi-Key; ComponentLink3Description: https://datasheet.ciiva.com/2456/pyu-r-int-thick-7-2456973.pdf?src-supplier=Digi-Key; ComponentLink4URL: https://datasheet.ciiva.com/16747/rc0805-16747087.pdf?src-supplier=Future+Electronics; ComponentLink4Description: https://datasheet.ciiva.com/16747/rc0805-16747087.pdf?src-supplier=Future+Electronics; ComponentLink5URL: https://datasheet.ciiva.com/46447/444164-46447563.pdf?src-supplier=Element14; ComponentLink5Description: https://datasheet.ciiva.com/46447/444164-46447563.pdf?src-supplier=Element14; ComponentLink6URL: https://datasheet.ciiva.com/2456/pyu-r-int-thick-7-2456972.pdf?src-supplier=Digi-Key; ComponentLink6Description: https://datasheet.ciiva.com/2456/pyu-r-int-thick-7-2456972.pdf?src-supplier=Digi-Key; ComponentLink7URL: https://datasheet.ciiva.com/2456/pyu-r-int-thick-7-2456974.pdf?src-supplier=Digi-Key; ComponentLink7Description: https://datasheet.ciiva.com/2456/pyu-r-int-thick-7-2456974.pdf?src-supplier=Digi-Key; Supplier Part Number 1: 311-10.0KCRCT-ND; Stock 1: 31284302; IPC7352C: done; SCHChecked: Initials after checked
R58 = R_4k7_RC0805FR-074K7L: YAGEO (PHYCOMP)         RC0805FR-074K7L             SMD Chip Resistor, Thick Film, 4.7 kohm, 150 V, 0805 [2012 Metric], 250 mW,  1%; Resistance: 4.7kR; Temperature Coefficient: 100ppm/°C; Voltage Rating (DC): 150V; Power Rating: 125mW; PCBChecked: initials after Checked; Supplier 1: Digi-Key; Manufacturer Part Number: RC0805FR-074K7L; RoHS: Yes; Category: Chip SMD Resistors; Case/Package: 0805; Number of Pins: 2; Case Code (Metric): 2012; Case Code (Imperial): 0805; Min Operating Temperature: -55°C; Max Operating Temperature: 155°C; Packaging: Tape and Reel; Tolerance: 1%; Composition: Thick Film; Voltage Rating: 150V; Number of Terminations: 2; Termination: SMD/SMT; Military Standard: Not; Package Quantity: 5000; Max Power Dissipation: 125mW; Features: Moisture Resistant; Length: 0.079inch; Height: 0.024inch; Width: 0.049inch; Depth: 1.25mm; REACH SVHC: No SVHC; Lead Free: Lead Free; ComponentLink1URL: https://datasheet.ciiva.com/11808/0900766b8106beab-11808155.pdf?src-supplier=RSComponents; ComponentLink1Description: https://datasheet.ciiva.com/11808/0900766b8106beab-11808155.pdf?src-supplier=RSComponents; ComponentLink2URL: https://datasheet.ciiva.com/7941/444164-7941804.pdf?src-supplier=Element14; ComponentLink2Description: https://datasheet.ciiva.com/7941/444164-7941804.pdf?src-supplier=Element14; ComponentLink3URL: https://datasheet.ciiva.com/7941/1686128-7941805.pdf?src-supplier=Element14; ComponentLink3Description: https://datasheet.ciiva.com/7941/1686128-7941805.pdf?src-supplier=Element14; ComponentLink4URL: https://datasheet.ciiva.com/7941/444164-7941806.pdf?src-supplier=Element14; ComponentLink4Description: https://datasheet.ciiva.com/7941/444164-7941806.pdf?src-supplier=Element14; ComponentLink5URL: https://datasheet.ciiva.com/6547/pyu-r-int-thick-7-6547263.pdf?src-supplier=Digi-Key; ComponentLink5Description: https://datasheet.ciiva.com/6547/pyu-r-int-thick-7-6547263.pdf?src-supplier=Digi-Key; ComponentLink6URL: https://datasheet.ciiva.com/46447/444164-46447583.pdf?src-supplier=Element14; ComponentLink6Description: https://datasheet.ciiva.com/46447/444164-46447583.pdf?src-supplier=Element14; Supplier Part Number 1: 311-4.70KCRDKR-ND; Manufacturer: Yageo; Stock 1: 4169266; IPC7352C: done; SCHChecked: Initials after checked
R59 R61 R68 = R_1k_RC0805FR-071KL: RESISTOR, 0805 1K 1%, FULL REEL; Product Range:YAGEO - RC Series; Resistance:1kohm; Power Rating:125mW; Resistance Tolerance:± 1%; Resistor Case Style:0805 [2012 Metric]; Resistor Element Material:Thick Film; Temperature Coefficient:± 250ppm/°C; Voltage Rating:150V; Packaging:Tape & Reel; MSL:-; SVHC:No SVHC (16-Dec-2013); External Depth:0.55mm; External Length / Height:2mm; External Width:1.25mm; No. of Pins:2; Operating Temperature Max:155°C; Operating Temperature Min:-55°C; Operating Temperature Range:-55°C to +155°C; Reel Quantity:5000; Resistor Mounting:SMD; Series:RC12H; Temperature Coef; Manufacturer: Yageo; Temperature Coefficient: 100ppm/°C; Resistance: 1kR; Power Rating: 125mW; Voltage Rating: 150V; PCBChecked: initials after Checked; Supplier 1: Digi-Key; Manufacturer Part Number: RC0805FR-071KL; RoHS: Yes; Category: Chip SMD Resistors; Case/Package: 0805; Number of Pins: 2; Case Code (Metric): 2012; Case Code (Imperial): 0805; Min Operating Temperature: -55°C; Max Operating Temperature: 155°C; Tolerance: 1%; Packaging: Tape and Reel; Features: Moisture Resistant; Max Power Dissipation: 125mW; Package Quantity: 1; Voltage Rating (DC): 150V; Composition: Thick Film; Number of Terminations: 2; Termination: SMD/SMT; Military Standard: Not; Length: 0.079inch; Height: 0.024inch; Width: 0.049inch; Depth: 1.25mm; Lead Free: Lead Free; REACH SVHC: Unknown; ComponentLink1URL: https://datasheet.ciiva.com/2456/pyu-r-int-thick-7-2456976.pdf?src-supplier=Digi-Key; ComponentLink1Description: https://datasheet.ciiva.com/2456/pyu-r-int-thick-7-2456976.pdf?src-supplier=Digi-Key; ComponentLink2URL: https://datasheet.ciiva.com/2456/pyu-r-int-thick-7-2456977.pdf?src-supplier=Digi-Key; ComponentLink2Description: https://datasheet.ciiva.com/2456/pyu-r-int-thick-7-2456977.pdf?src-supplier=Digi-Key; ComponentLink3URL: https://datasheet.ciiva.com/7941/1686128-7941719.pdf?src-supplier=Element14; ComponentLink3Description: https://datasheet.ciiva.com/7941/1686128-7941719.pdf?src-supplier=Element14; ComponentLink4URL: https://datasheet.ciiva.com/16850/rc0805-16850409.pdf?src-supplier=Future+Electronics; ComponentLink4Description: https://datasheet.ciiva.com/16850/rc0805-16850409.pdf?src-supplier=Future+Electronics; ComponentLink5URL: https://datasheet.ciiva.com/46385/444164-46385020.pdf?src-supplier=Element14; ComponentLink5Description: https://datasheet.ciiva.com/46385/444164-46385020.pdf?src-supplier=Element14; ComponentLink6URL: https://datasheet.ciiva.com/2456/pyu-r-int-thick-7-2456975.pdf?src-supplier=Digi-Key; ComponentLink6Description: https://datasheet.ciiva.com/2456/pyu-r-int-thick-7-2456975.pdf?src-supplier=Digi-Key; Supplier Part Number 1: 311-1.00KCRCT-ND; Stock 1: 23230285; IPC7352C: done; SCHChecked: Initials after checked
R60 = R_22R_RC0805FR-0722RL: RES SMD 22 OHM 1% 1/8W 0805; Manufacturer: Yageo; Temperature Coefficient: 100ppm/°C; Power Rating: 125mW; Voltage Rating: 150V; PCBChecked: initials after Checked; Supplier 1: Digi-Key; Manufacturer Part Number: RC0805FR-0722RL; RoHS: Yes; Category: Chip SMD Resistors; Case/Package: 0805; Case Code (Metric): 2012; Case Code (Imperial): 0805; Min Operating Temperature: -55°C; Max Operating Temperature: 155°C; Resistance: 22R; Tolerance: 1%; Packaging: Tape and Reel; Composition: Thick Film; Termination: SMD/SMT; Military Standard: Not; Package Quantity: 1; Number of Terminations: 2; Max Power Dissipation: 125mW; Features: Moisture Resistant; Working Voltage: 150V; Length: 0.079inch; Height: 0.024inch; Width: 0.049inch; Depth: 1.25mm; REACH SVHC: Unknown; Lead Free: Lead Free; ComponentLink1URL: https://datasheet.ciiva.com/11819/0900766b8106beab-11819837.pdf?src-supplier=RSComponents; ComponentLink1Description: https://datasheet.ciiva.com/11819/0900766b8106beab-11819837.pdf?src-supplier=RSComponents; ComponentLink2URL: https://datasheet.ciiva.com/2457/pyu-r-int-thick-7-2457045.pdf?src-supplier=Digi-Key; ComponentLink2Description: https://datasheet.ciiva.com/2457/pyu-r-int-thick-7-2457045.pdf?src-supplier=Digi-Key; ComponentLink3URL: https://datasheet.ciiva.com/2457/pyu-r-int-thick-7-2457046.pdf?src-supplier=Digi-Key; ComponentLink3Description: https://datasheet.ciiva.com/2457/pyu-r-int-thick-7-2457046.pdf?src-supplier=Digi-Key; ComponentLink4URL: https://datasheet.ciiva.com/12667/rc0805-12667371.pdf?src-supplier=Mouser; ComponentLink4Description: https://datasheet.ciiva.com/12667/rc0805-12667371.pdf?src-supplier=Mouser; ComponentLink5URL: https://datasheet.ciiva.com/2457/pyu-r-int-thick-7-2457044.pdf?src-supplier=Digi-Key; ComponentLink5Description: https://datasheet.ciiva.com/2457/pyu-r-int-thick-7-2457044.pdf?src-supplier=Digi-Key; ComponentLink6URL: https://datasheet.ciiva.com/46447/444164-46447574.pdf?src-supplier=Element14; ComponentLink6Description: https://datasheet.ciiva.com/46447/444164-46447574.pdf?src-supplier=Element14; Supplier Part Number 1: 311-22.0CRCT-ND; Stock 1: 302752; IPC7352C: done; SCHChecked: Initials after checked
R62 R64 R66 = R_1k_RC0805FR-071KL: RESISTOR, 0805 1K 1%, FULL REEL; Product Range:YAGEO - RC Series; Resistance:1kohm; Power Rating:125mW; Resistance Tolerance:± 1%; Resistor Case Style:0805 [2012 Metric]; Resistor Element Material:Thick Film; Temperature Coefficient:± 250ppm/°C; Voltage Rating:150V; Packaging:Tape & Reel; MSL:-; SVHC:No SVHC (16-Dec-2013); External Depth:0.55mm; External Length / Height:2mm; External Width:1.25mm; No. of Pins:2; Operating Temperature Max:155°C; Operating Temperature Min:-55°C; Operating Temperature Range:-55°C to +155°C; Reel Quantity:5000; Resistor Mounting:SMD; Series:RC12H; Temperature Coef; Manufacturer: Yageo; Temperature Coefficient: 100ppm/°C; Resistance: 1kR; Power Rating: 125mW; Voltage Rating: 150V; Supplier 1: Digi-Key; Manufacturer Part Number: RC0805FR-071KL; RoHS: Yes; Category: Chip SMD Resistors; Case/Package: 0805; Number of Pins: 2; Case Code (Metric): 2012; Case Code (Imperial): 0805; Min Operating Temperature: -55°C; Max Operating Temperature: 155°C; Tolerance: 1%; Packaging: Tape and Reel; Features: Moisture Resistant; Max Power Dissipation: 125mW; Package Quantity: 1; Voltage Rating (DC): 150V; Composition: Thick Film; Number of Terminations: 2; Termination: SMD/SMT; Military Standard: Not; Length: 0.079inch; Height: 0.024inch; Width: 0.049inch; Depth: 1.25mm; Lead Free: Lead Free; REACH SVHC: Unknown; ComponentLink1URL: https://datasheet.ciiva.com/2456/pyu-r-int-thick-7-2456976.pdf?src-supplier=Digi-Key; ComponentLink1Description: https://datasheet.ciiva.com/2456/pyu-r-int-thick-7-2456976.pdf?src-supplier=Digi-Key; ComponentLink2URL: https://datasheet.ciiva.com/2456/pyu-r-int-thick-7-2456977.pdf?src-supplier=Digi-Key; ComponentLink2Description: https://datasheet.ciiva.com/2456/pyu-r-int-thick-7-2456977.pdf?src-supplier=Digi-Key; ComponentLink3URL: https://datasheet.ciiva.com/7941/1686128-7941719.pdf?src-supplier=Element14; ComponentLink3Description: https://datasheet.ciiva.com/7941/1686128-7941719.pdf?src-supplier=Element14; ComponentLink4URL: https://datasheet.ciiva.com/16850/rc0805-16850409.pdf?src-supplier=Future+Electronics; ComponentLink4Description: https://datasheet.ciiva.com/16850/rc0805-16850409.pdf?src-supplier=Future+Electronics; ComponentLink5URL: https://datasheet.ciiva.com/46385/444164-46385020.pdf?src-supplier=Element14; ComponentLink5Description: https://datasheet.ciiva.com/46385/444164-46385020.pdf?src-supplier=Element14; ComponentLink6URL: https://datasheet.ciiva.com/2456/pyu-r-int-thick-7-2456975.pdf?src-supplier=Digi-Key; ComponentLink6Description: https://datasheet.ciiva.com/2456/pyu-r-int-thick-7-2456975.pdf?src-supplier=Digi-Key; Supplier Part Number 1: 311-1.00KCRCT-ND; Stock 1: 23230285
R63 R72 = R_27k_RC0805FR-0727KL: Surface Mount Thick Film Resistor, RC Series, 27 kohm, 125 mW, - 1%, 150 V, 0805 [2012 Metric]; Manufacturer: Yageo; Resistance: 27kR; Temperature Coefficient: 100ppm/°C; Power Rating: 125mW; Voltage Rating: 150V; Supplier 1: Digi-Key; Manufacturer Part Number: RC0805FR-0727KL; RoHS: Yes; Category: Chip SMD Resistors; Stock 1: 307907; Pricing 1: 1=0,10000, 10=0,04000, 100=0,01630, 1000=0,00731, 2500=0,00635 (USD); Case/Package: 0805; Case Code (Metric): 2012; Case Code (Imperial): 0805; Min Operating Temperature: -55°C; Max Operating Temperature: 155°C; Tolerance: 1%; Composition: Thick Film; Packaging: Tape and Reel; Package Quantity: 1; Number of Terminations: 2; Termination: SMD/SMT; Military Standard: Not; Max Power Dissipation: 125mW; Features: Moisture Resistant; Length: 2mm; Height: 0.5mm; Width: 0.049inch; Depth: 1.25mm; Lead Free: Lead Free; REACH SVHC: Unknown; ComponentLink1URL: https://datasheet.ciiva.com/11809/0900766b8106beab-11809381.pdf?src-supplier=RSComponents; ComponentLink1Description: https://datasheet.ciiva.com/11809/0900766b8106beab-11809381.pdf?src-supplier=RSComponents; ComponentLink2URL: https://datasheet.ciiva.com/2457/pyu-r-int-thick-7-2457986.pdf?src-supplier=Digi-Key; ComponentLink2Description: https://datasheet.ciiva.com/2457/pyu-r-int-thick-7-2457986.pdf?src-supplier=Digi-Key; ComponentLink3URL: https://datasheet.ciiva.com/2457/pyu-r-int-thick-7-2457988.pdf?src-supplier=Digi-Key; ComponentLink3Description: https://datasheet.ciiva.com/2457/pyu-r-int-thick-7-2457988.pdf?src-supplier=Digi-Key; ComponentLink4URL: https://datasheet.ciiva.com/7941/444164-7941751.pdf?src-supplier=Element14; ComponentLink4Description: https://datasheet.ciiva.com/7941/444164-7941751.pdf?src-supplier=Element14; ComponentLink5URL: https://datasheet.ciiva.com/2457/pyu-r-int-thick-7-2457987.pdf?src-supplier=Digi-Key; ComponentLink5Description: https://datasheet.ciiva.com/2457/pyu-r-int-thick-7-2457987.pdf?src-supplier=Digi-Key; ComponentLink6URL: https://datasheet.ciiva.com/7941/444164-7941750.pdf?src-supplier=Element14; ComponentLink6Description: https://datasheet.ciiva.com/7941/444164-7941750.pdf?src-supplier=Element14; Supplier Part Number 1: 311-27.0KCRCT-ND